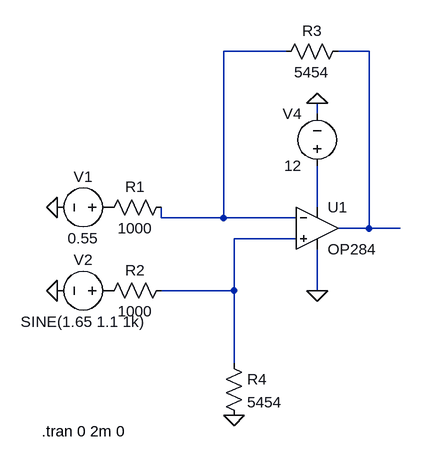
[diagram p0: schematic DiffSimulator.asc]
DiffSimulator.asc, the LTspice schematic file:
Version 4
SHEET 1 880 680
WIRE 144 -224 48 -224
WIRE 272 -224 224 -224
WIRE 192 -128 192 -144
WIRE 192 16 192 -48
WIRE -48 32 -48 16
WIRE 48 32 48 -224
WIRE 48 32 -48 32
WIRE 160 32 48 32
WIRE 272 48 272 -224
WIRE 272 48 224 48
WIRE 320 48 272 48
WIRE 160 64 64 64
WIRE 64 144 64 64
WIRE 64 144 -48 144
WIRE 192 144 192 80
WIRE 64 256 64 144
FLAG -208 144 0
FLAG 192 -144 0
FLAG 192 144 0
FLAG 64 336 0
FLAG -208 16 0
DATAFLAG 304 48 ""
SYMBOL voltage -112 144 R90
WINDOW 0 -32 56 VBottom 2
WINDOW 3 32 56 VTop 2
WINDOW 123 0 0 Left 0
WINDOW 39 0 0 Left 0
SYMATTR InstName V2
SYMATTR Value SINE(1.65 1.1 1k)
SYMBOL res -32 0 R90
WINDOW 0 0 56 VBottom 2
WINDOW 3 32 56 VTop 2
SYMATTR InstName R1
SYMATTR Value 1000
SYMBOL res -32 128 R90
WINDOW 0 0 56 VBottom 2
WINDOW 3 32 56 VTop 2
SYMATTR InstName R2
SYMATTR Value 1000
SYMBOL res 240 -240 R90
WINDOW 0 0 56 VBottom 2
WINDOW 3 32 56 VTop 2
SYMATTR InstName R3
SYMATTR Value 5454
SYMBOL res 48 240 R0
SYMATTR InstName R4
SYMATTR Value 5454
SYMBOL voltage 192 -32 R180
WINDOW 0 24 96 Left 2
WINDOW 3 24 16 Left 2
WINDOW 123 0 0 Left 0
WINDOW 39 0 0 Left 0
SYMATTR InstName V4
SYMATTR Value 12
SYMBOL voltage -112 16 R90
WINDOW 0 -32 56 VBottom 2
WINDOW 3 32 56 VTop 2
WINDOW 123 0 0 Left 0
WINDOW 39 0 0 Left 0
SYMATTR InstName V1
SYMATTR Value 0.55
SYMBOL OpAmps\\OP284 192 -16 R0
SYMATTR InstName U1
TEXT -232 360 Left 2 !.tran 0 2m 0

The netlist it stands for:
* DiffSimulator.asc
V2 P001 0 SINE(1.65 1.1 1k)
R1 N001 P002 1000
R2 N004 P001 1000
R3 N002 N001 5454
R4 N004 0 5454
V4 N003 0 12
V1 P002 0 0.55
XU1 N004 N001 N003 0 N002 OP284  ; pins In+ In- V+ V- OUT
.tran 0 2m 0
.lib ADI1.lib
.backanno
.end